# EAGLE design BEDBackpack_v11 (EAGLE 5.10)
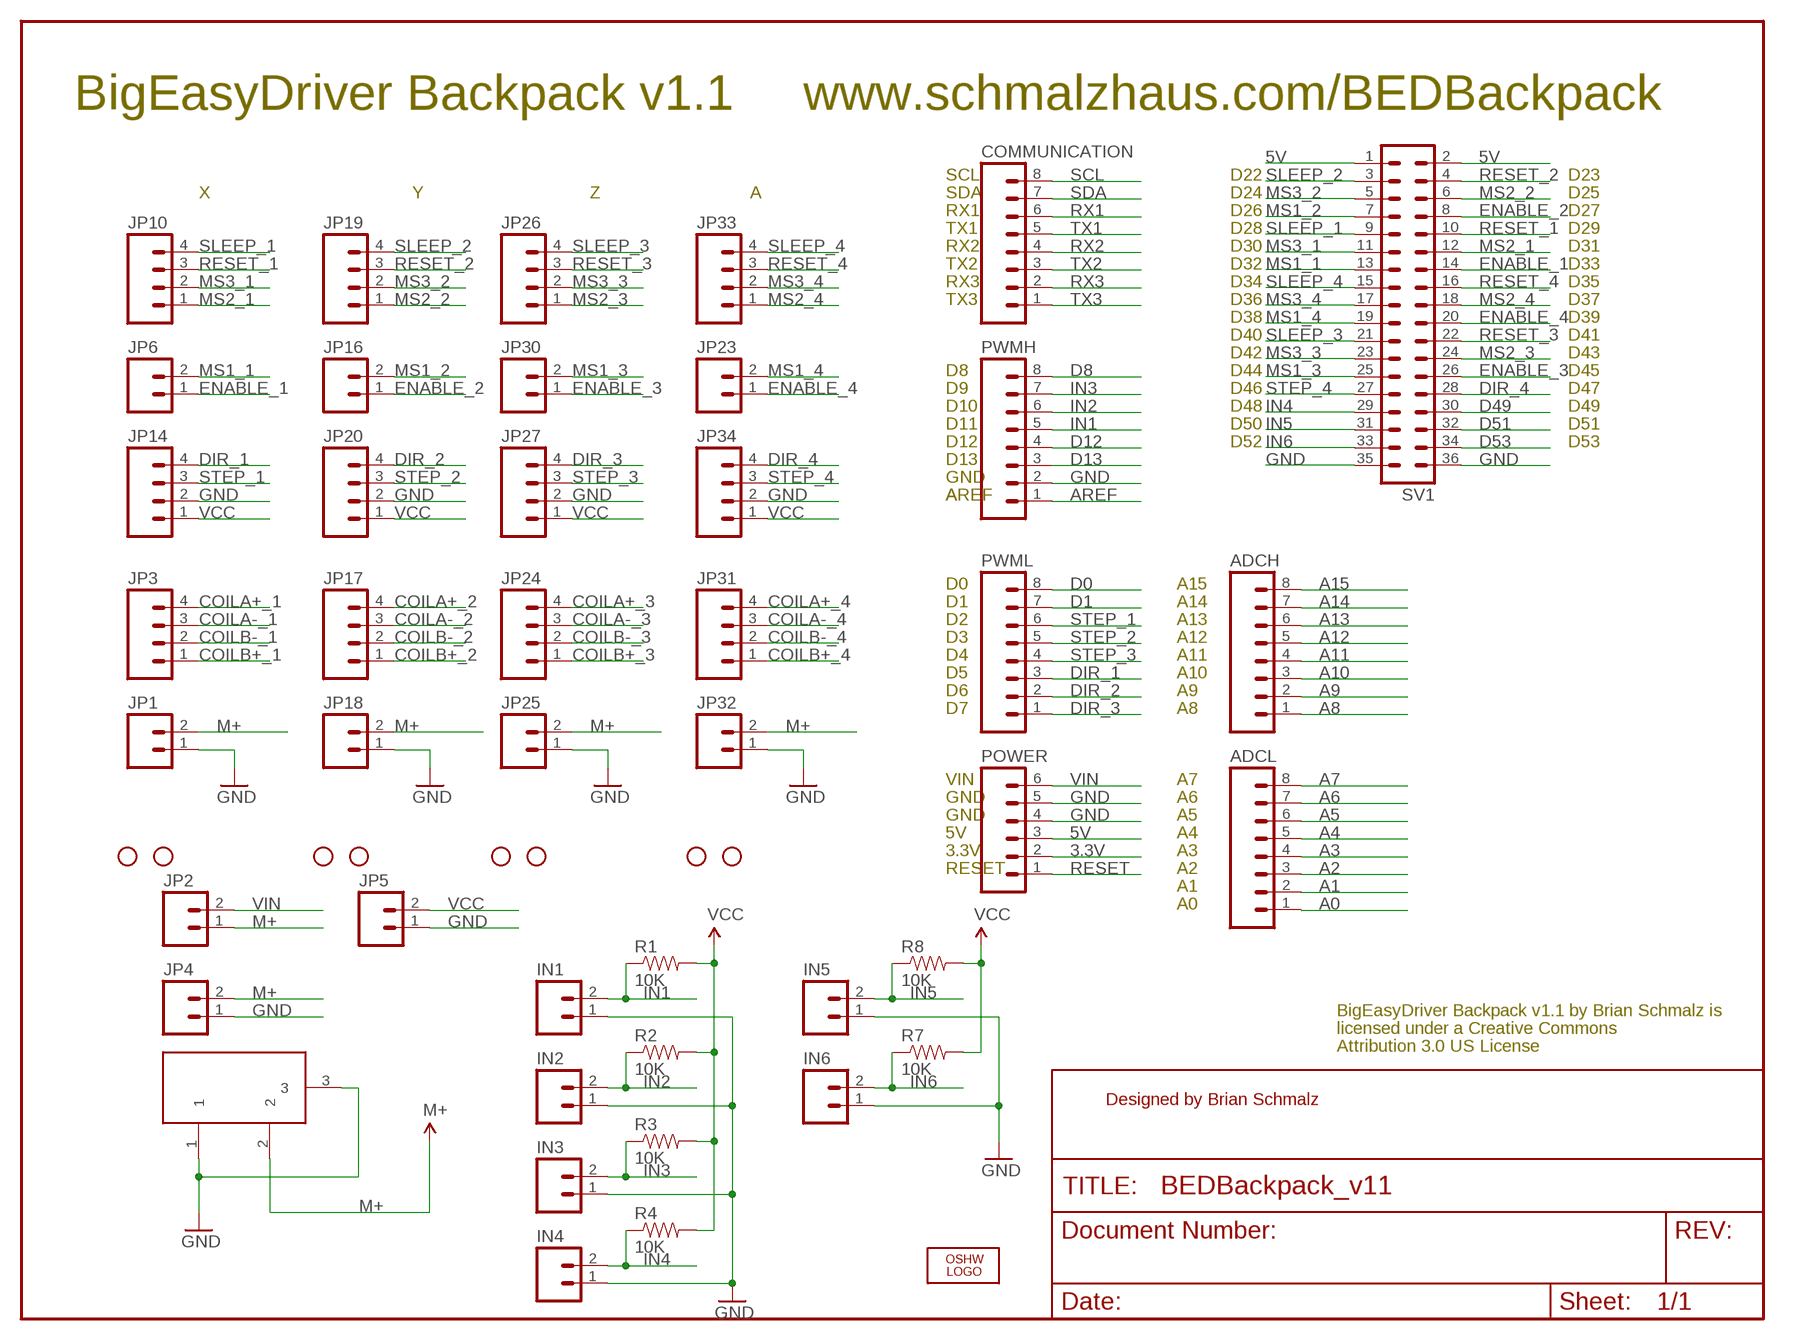
[diagram p0: schematic, sheet 1]

## Parts
ADCH  M08  [1X08]
ADCL  M08  [1X08]
COMMUNICATION  M08  [1X08]
IN1  M023.5MM  [SCREWTERMINAL-3.5MM-2]
IN2  M023.5MM  [SCREWTERMINAL-3.5MM-2]
IN3  M023.5MM  [SCREWTERMINAL-3.5MM-2]
IN4  M023.5MM  [SCREWTERMINAL-3.5MM-2]
IN5  M023.5MM  [SCREWTERMINAL-3.5MM-2]
IN6  M023.5MM  [SCREWTERMINAL-3.5MM-2]
JP1  M02PTH  [1X02]
JP2  M02PTH  [1X02]
JP3  M04PTH  [1X04]
JP4  M02PTH  [1X02]
JP5  M02PTH  [1X02]
JP6  M02PTH  [1X02]
JP8  STAND-OFF  [STAND-OFF]
JP9  STAND-OFF  [STAND-OFF]
JP10  M04PTH  [1X04]
JP13  STAND-OFF  [STAND-OFF]
JP14  M04PTH  [1X04]
JP15  STAND-OFF  [STAND-OFF]
JP16  M02PTH  [1X02]
JP17  M04PTH  [1X04]
JP18  M02PTH  [1X02]
JP19  M04PTH  [1X04]
JP20  M04PTH  [1X04]
JP21  STAND-OFF  [STAND-OFF]
JP22  STAND-OFF  [STAND-OFF]
JP23  M02PTH  [1X02]
JP24  M04PTH  [1X04]
JP25  M02PTH  [1X02]
JP26  M04PTH  [1X04]
JP27  M04PTH  [1X04]
JP28  STAND-OFF  [STAND-OFF]
JP29  STAND-OFF  [STAND-OFF]
JP30  M02PTH  [1X02]
JP31  M04PTH  [1X04]
JP32  M02PTH  [1X02]
JP33  M04PTH  [1X04]
JP34  M04PTH  [1X04]
LOGO1  OSHW_LOGO_FILLX0350-NT  [OSHW_FILLX350_NOTEXT]
POWER  M06SIP  [1X06]
PWMH  M08  [1X08]
PWML  M08  [1X08]
R1  10K  RESISTORPTH-1/6W  [1/6W-RES]
R2  10K  RESISTORPTH-1/6W  [1/6W-RES]
R3  10K  RESISTORPTH-1/6W  [1/6W-RES]
R4  10K  RESISTORPTH-1/6W  [1/6W-RES]
R7  10K  RESISTORPTH-1/6W  [1/6W-RES]
R8  10K  RESISTORPTH-1/6W  [1/6W-RES]
SV1  MA18-2  [MA18-2]
X2  DC21MMX  [DC-21MM]

## Nets
3.3V: POWER.2
5V: POWER.3 SV1.1 SV1.2
A0: ADCL.1
A1: ADCL.2
A2: ADCL.3
A3: ADCL.4
A4: ADCL.5
A5: ADCL.6
A6: ADCL.7
A7: ADCL.8
A8: ADCH.1
A9: ADCH.2
A10: ADCH.3
A11: ADCH.4
A12: ADCH.5
A13: ADCH.6
A14: ADCH.7
A15: ADCH.8
AREF: PWMH.1
COILA+_1: JP3.4
COILA+_2: JP17.4
COILA+_3: JP24.4
COILA+_4: JP31.4
COILA-_1: JP3.3
COILA-_2: JP17.3
COILA-_3: JP24.3
COILA-_4: JP31.3
COILB+_1: JP3.1
COILB+_2: JP17.1
COILB+_3: JP24.1
COILB+_4: JP31.1
COILB-_1: JP3.2
COILB-_2: JP17.2
COILB-_3: JP24.2
COILB-_4: JP31.2
D0: PWML.8
D1: PWML.7
D8: PWMH.8
D12: PWMH.4
D13: PWMH.3
D49: SV1.30
D51: SV1.32
D53: SV1.34
DIR_1: JP14.4 PWML.3
DIR_2: JP20.4 PWML.2
DIR_3: JP27.4 PWML.1
DIR_4: JP34.4 SV1.28
ENABLE_1: JP6.1 SV1.14
ENABLE_2: JP16.1 SV1.8
ENABLE_3: JP30.1 SV1.26
ENABLE_4: JP23.1 SV1.20
GND: IN1.1 IN2.1 IN3.1 IN4.1 IN5.1 IN6.1 JP1.1 JP4.1 JP5.1 JP14.2 JP18.1 JP20.2 JP25.1 JP27.2 JP32.1 JP34.2 POWER.4 POWER.5 PWMH.2 SV1.35 SV1.36 X2.1 X2.3
IN1: IN1.2 PWMH.5 R1.1
IN2: IN2.2 PWMH.6 R2.1
IN3: IN3.2 PWMH.7 R3.1
IN4: IN4.2 R4.1 SV1.29
IN5: IN5.2 R8.1 SV1.31
IN6: IN6.2 R7.1 SV1.33
M+: JP1.2 JP2.1 JP4.2 JP18.2 JP25.2 JP32.2 X2.2
MS1_1: JP6.2 SV1.13
MS1_2: JP16.2 SV1.7
MS1_3: JP30.2 SV1.25
MS1_4: JP23.2 SV1.19
MS2_1: JP10.1 SV1.12
MS2_2: JP19.1 SV1.6
MS2_3: JP26.1 SV1.24
MS2_4: JP33.1 SV1.18
MS3_1: JP10.2 SV1.11
MS3_2: JP19.2 SV1.5
MS3_3: JP26.2 SV1.23
MS3_4: JP33.2 SV1.17
RESET: POWER.1
RESET_1: JP10.3 SV1.10
RESET_2: JP19.3 SV1.4
RESET_3: JP26.3 SV1.22
RESET_4: JP33.3 SV1.16
RX1: COMMUNICATION.6
RX2: COMMUNICATION.4
RX3: COMMUNICATION.2
SCL: COMMUNICATION.8
SDA: COMMUNICATION.7
SLEEP_1: JP10.4 SV1.9
SLEEP_2: JP19.4 SV1.3
SLEEP_3: JP26.4 SV1.21
SLEEP_4: JP33.4 SV1.15
STEP_1: JP14.3 PWML.6
STEP_2: JP20.3 PWML.5
STEP_3: JP27.3 PWML.4
STEP_4: JP34.3 SV1.27
TX1: COMMUNICATION.5
TX2: COMMUNICATION.3
TX3: COMMUNICATION.1
VCC: JP5.2 JP14.1 JP20.1 JP27.1 JP34.1 R1.2 R2.2 R3.2 R4.2 R7.2 R8.2
VIN: JP2.2 POWER.6

## Notes on the sheet
- BigEasyDriver Backpack v1.1 | www.schmalzhaus.com/BEDBackpack
- SCL | D22 | D23
- X | Y | Z | A | SDA | D24 | D25
- RX1 | D26 | D27
- TX1 | D28 | D29
- RX2 | D30 | D31
- TX2 | D32 | D33
- RX3 | D34 | D35
- TX3 | D36 | D37
- D38 | D39
- D40 | D41
- D42 | D43
- D8 | D44 | D45
- D9 | D46 | D47
- D10 | D48 | D49
- D11 | D50 | D51
- D12 | D52 | D53
- D13
- GND
- A | AREF
- D0 | A15
- D1 | A14
- D2 | A13
- D3 | A12
- D4 | A11
- D5 | A10
- D6 | A9
- D7 | A8
- VIN | A7
- GND | A6
- GND | A5
- 5V | A4
- 3.3V | A3
- RESET | A2
- A1
- A0
- BigEasyDriver Backpack v1.1 by Brian Schmalz is
- licensed under a Creative Commons
- Attribution 3.0 US License
- Designed by Brian Schmalz

## Library data of the parts
ADCH ADCL COMMUNICATION PWMH PWML = SparkFun-08-03-10:M08: Header 8 Standard 8-pin 0.1" header. Use with straight break away headers (SKU : PRT-00116), right angle break away headers (PRT-00553), swiss pins (PRT-00743), machine pins (PRT-00117), and female headers (PRT-00115).
IN1-IN6 = SparkFun-08-03-10:M02: Header 2 Standard 2-pin 0.1" header. Use with straight break away headers (SKU : PRT-00116), right angle break away headers (PRT-00553), swiss pins (PRT-00743), machine pins (PRT-00117), and female headers (PRT-00115). Molex polarized connector foot print use with SKU : PRT-08233 with associated crimp pins and housings.
JP1 JP2 JP4-JP6 JP16 JP18 JP23 JP25 JP30 JP32 = SparkFun:M02: Header 2 Standard 2-pin 0.1" header. Use with straight break away headers (SKU : PRT-00116), right angle break away headers (PRT-00553), swiss pins (PRT-00743), machine pins (PRT-00117), and female headers (PRT-00115). Molex polarized connector foot print use with SKU : PRT-08233 with associated crimp pins and housings.
JP3 JP10 JP14 JP17 JP19 JP20 JP24 JP26 JP27 JP31 JP33 JP34 = SparkFun:M04: Header 4 Standard 4-pin 0.1" header. Use with straight break away headers (SKU : PRT-00116), right angle break away headers (PRT-00553), swiss pins (PRT-00743), machine pins (PRT-00117), and female headers (PRT-00115). Molex polarized connector foot print use with SKU : PRT-08231 with associated crimp pins and housings.
JP8 JP9 JP13 JP15 JP21 JP22 JP28 JP29 = SparkFun-7-28-09:STAND-OFF: Stand Off This is the mechanical footprint for a #4 phillips button head screw. Use the keepout ring to avoid running the screw head into surrounding components. SKU : PRT-00447
LOGO1 = OSHW:OSHW_LOGO_FILL
POWER = SparkFun-08-03-10:M06: Header 6 Standard 6-pin 0.1" header. Use with straight break away headers (SKU : PRT-00116), right angle break away headers (PRT-00553), swiss pins (PRT-00743), machine pins (PRT-00117), and female headers (PRT-00115). Molex polarized connector foot print use with SKU : PRT-08094 with associated crimp pins and housings. NOTES ON THE VARIANTS LOCK and LOCK_LONGPADS... This footprint was designed to help hold the alignment of a through-hole component (i.e. 6-pin header) while soldering it into place. You may notice that each hole has been shifted either up or down by 0.005 of an inch from it's more standard position (which is a perfectly straight line). This slight alteration caused the pins (the squares in the middle) to touch the edges of the holes. Because they are alternating, it causes a "brace" to hold the component in place. 0.005 has proven to be the perfect amount of "off-center" position when using our standard breakaway headers. Although looks a little odd when you look at the bare footprint, once you have a header in there, the alteration is very hard to notice. Also, if you push a header all the way into place, it is covered up entirely on the bottom side. This idea of altering the position of holes to aid alignment will be further integrated into the Sparkfun Library for other footprints. It can help hold any component with 3 or more connection pins.
R1-R4 R7 R8 = SparkFun-08-03-10:RESISTOR: Resistor Basic schematic elements and footprints for 0603, 1206, and PTH resistors.
SV1 = con-lstb:MA18-2: PIN HEADER
X2 = powersupply:DC21MM

## Net classes
0 default: width 0.203 mm, drill 0.406 mm, clearance 0.203 mm

## Board
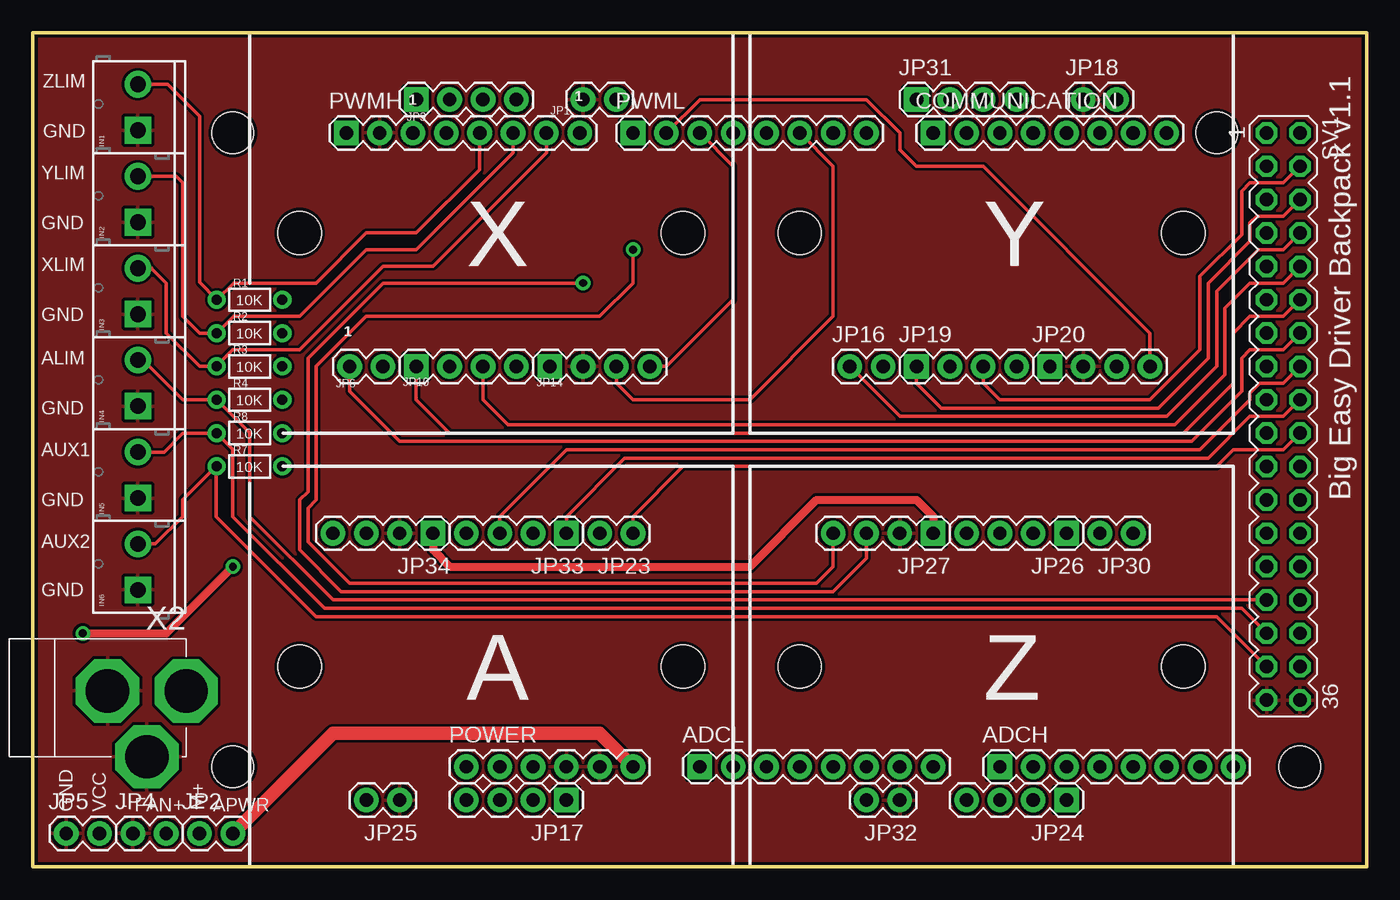
[diagram p1: board, top side]
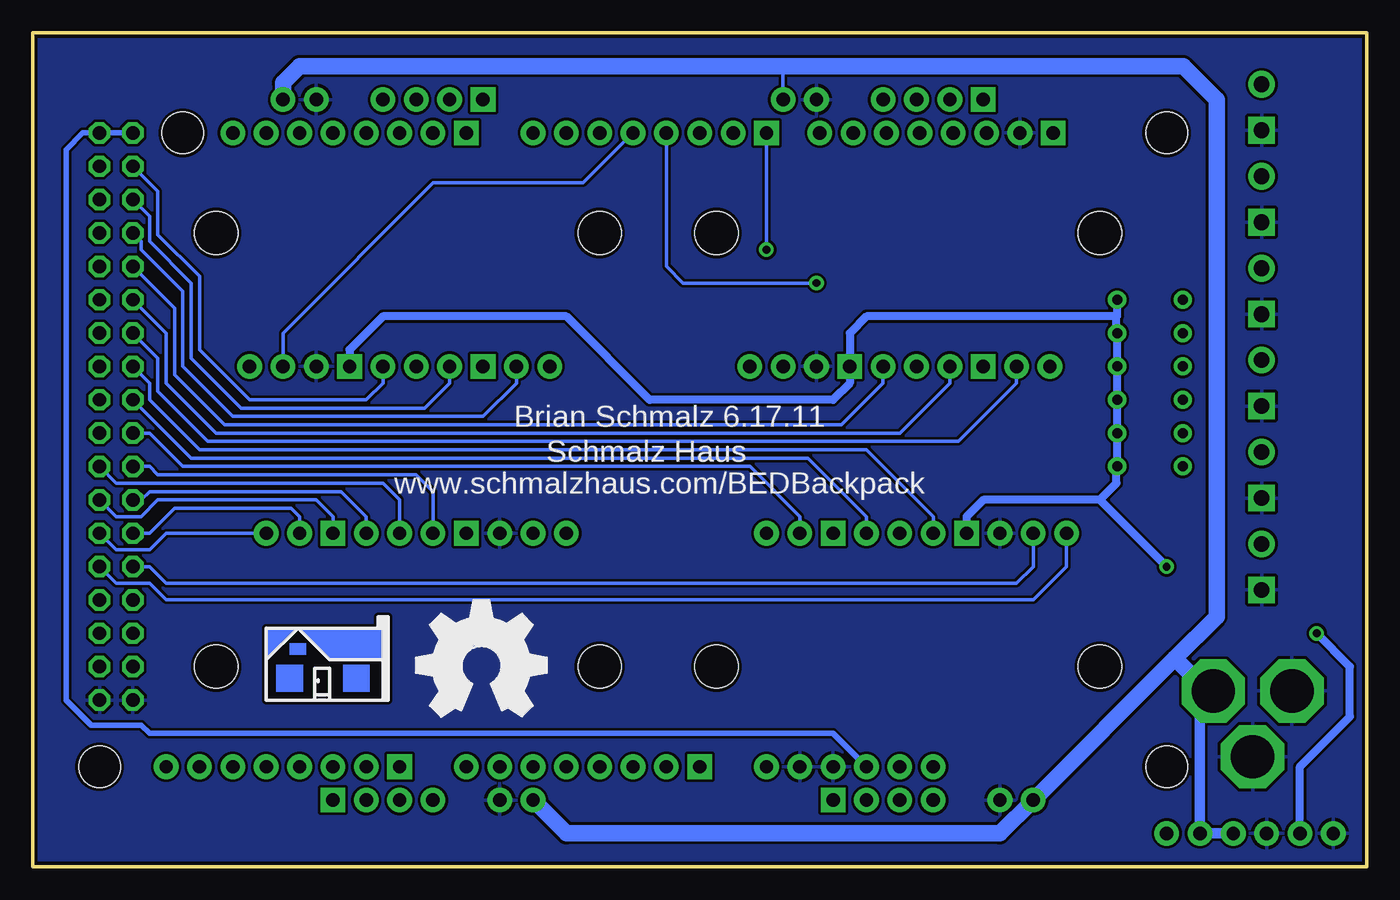
[diagram p2: board, bottom side, seen from below]

Size 101.6 x 63.5 mm. Coordinates in mm from the lower left corner, seen from the top.
Outline: 0,0 101.6,0 101.6,63.5 0,63.5 0,0
Copper layers (1*16): Top 0.035mm / dielectric 1.5mm / Bottom 0.035mm
Design rules "GoldPhoenix_8and8_4layer *": minimum track width 7mil, minimum drill 15mil, track to track 8mil, track to pad 8mil, pad to pad 8mil, via to via 8mil, smd to smd 8mil, copper to edge 10mil, drill to drill 8mil, minimum pad ring 12mil, minimum via ring 10mil, stop-mask expansion 4mil, vias tented up to drill 25mil, thermal gap 10mil
Holes 3.17 mm at 15.24,55.88 15.24,7.62 96.52,7.62 90.17,55.88

### Footprints (pad centres in the part's own frame; a part is rotated, then mirrored left to right if it is on the bottom)
1X08 = drill 1.016 pad 1.88 square: 1 0,0 | drill 1.016 pad 1.88 round: 2 2.54,0; 3 5.08,0; 4 7.62,0; 5 10.16,0; 6 12.7,0; 7 15.24,0; 8 17.78,0
SCREWTERMINAL-3.5MM-2 = drill 1.2 pad 2.032 square: 1 0,0 | drill 1.2 pad 2.032 round: 2 3.5,0
1X02 = drill 1.016 pad 1.88 round: 1 0,0; 2 2.54,0
1X04 = drill 1.016 pad 1.88 square: 1 0,0 | drill 1.016 pad 1.88 round: 2 2.54,0; 3 5.08,0; 4 7.62,0
STAND-OFF = hole 3.302: 0,0
1X06 = drill 1.016 pad 1.88 round: 1 0,0; 2 2.54,0; 3 5.08,0; 4 7.62,0; 5 10.16,0; 6 12.7,0
1/6W-RES = drill 0.762 round: 1 -2.5,0; 2 2.5,0
MA18-2 = drill 1.016 octagon: 1 -21.59,-1.27; 2 -21.59,1.27; 3 -19.05,-1.27; 4 -19.05,1.27; 5 -16.51,-1.27; 6 -16.51,1.27; 7 -13.97,-1.27; 8 -13.97,1.27; 9 -11.43,-1.27; 10 -11.43,1.27; 11 -8.89,-1.27; 12 -8.89,1.27; 13 -6.35,-1.27; 14 -6.35,1.27; 15 -3.81,-1.27; 16 -3.81,1.27; 17 -1.27,-1.27; 18 -1.27,1.27; 19 1.27,-1.27; 20 1.27,1.27; 21 3.81,-1.27; 22 3.81,1.27; 23 6.35,-1.27; 24 6.35,1.27; 25 8.89,-1.27; 26 8.89,1.27; 27 11.43,-1.27; 28 11.43,1.27; 29 13.97,-1.27; 30 13.97,1.27; 31 16.51,-1.27; 32 16.51,1.27; 33 19.05,-1.27; 34 19.05,1.27; 35 21.59,-1.27; 36 21.59,1.27
DC-21MM = drill 3.302 pad 4.826 octagon: 1 -5.08,-3.353; 2 -0.076,-6.35; 3 -0.076,-0.356

### Placement (x,y rotation side)
ADCH  73.66,7.62 0 top
ADCL  50.8,7.62 0 top
COMMUNICATION  68.58,55.88 0 top
IN1  8,56.08 90 top
IN2  8,49.08 90 top
IN3  8,42.08 90 top
IN4  8,35.08 90 top
IN5  8,28.08 90 top
IN6  8,21.08 90 top
JP1  41.91,58.42 0 top
JP2  12.7,2.54 0 top
JP3  29.21,58.42 0 top
JP4  7.62,2.54 0 top
JP5  2.54,2.54 0 top
JP6  24.13,38.1 0 top
JP8  20.32,48.26 0 top
JP9  49.53,48.26 0 top
JP10  29.21,38.1 0 top
JP13  58.42,15.24 0 top
JP14  39.37,38.1 0 top
JP15  58.42,48.26 0 top
JP16  62.23,38.1 0 top
JP17  40.64,5.08 180 top
JP18  80.01,58.42 0 top
JP19  67.31,38.1 0 top
JP20  77.47,38.1 0 top
JP21  87.63,15.24 0 top
JP22  49.53,15.24 0 top
JP23  45.72,25.4 180 top
JP24  78.74,5.08 180 top
JP25  27.94,5.08 180 top
JP26  78.74,25.4 180 top
JP27  68.58,25.4 180 top
JP28  20.32,15.24 0 top
JP29  87.63,48.26 0 top
JP30  83.82,25.4 180 top
JP31  67.31,58.42 0 top
JP32  66.04,5.08 180 top
JP33  40.64,25.4 180 top
JP34  30.48,25.4 180 top
LOGO1  72.39,11.43 0 bottom
POWER  33.02,7.62 0 top
PWMH  23.88,55.88 0 top
PWML  45.72,55.88 0 top
R1  16.51,43.18 0 top
R2  16.51,40.64 0 top
R3  16.51,38.1 0 top
R4  16.51,35.56 0 top
R7  16.51,30.48 0 top
R8  16.51,33.02 0 top
SV1  95.25,34.29 270 top
U$1  [SCHMALZHAUS]  80.01,15.24 0 bottom
X2  5.33,13.46 90 top

### Tracks (layer width: path | path; a pad name or v marks a point on that pad's centre or on a via)
5V
  Bottom 0.406: SV1.1 SV1.2 97.79,55.88 99.06,54.61 99.06,12.7 97.16,10.79 93.34,10.79 92.71,10.16 40.64,10.16 POWER.3
DIR_1
  Top 0.254: PWML.3 53.34,53.34 53.34,43.18 48.26,38.1 JP14.4
DIR_2
  Top 0.254: PWML.2 50.8,58.42 63.5,58.42 66.04,55.88 66.04,54.61 67.31,53.34 72.39,53.34 85.09,40.64 JP20.4
DIR_3  (via drill 0.6)
  Top 0.254: v45.72,46.99 45.72,44.45 43.18,41.91 25.4,41.91 21.59,38.1 21.59,27.94 20.95,27.3 20.95,24.77 24.13,21.59 59.69,21.59 60.96,22.86 JP27.4
  Bottom 0.254: v45.72,46.99 PWML.1
DIR_4
  Bottom 0.254: JP34.4 22.86,22.86 25.4,20.32 91.44,20.32 92.71,21.59 95.25,21.59 SV1.28
ENABLE_1
  Top 0.254: SV1.14 95.25,39.37 92.71,39.37 92.08,38.73 92.08,36.2 88.27,32.38 27.94,32.38 24.13,36.2 JP6.1
ENABLE_2
  Top 0.254: SV1.8 95.25,46.99 93.34,46.99 90.17,43.81 90.17,38.1 86.36,34.29 66.04,34.29 JP16.1
ENABLE_3
  Bottom 0.254: SV1.26 95.25,24.13 92.71,24.13 91.44,25.4 JP30.1
ENABLE_4
  Top 0.254: SV1.20 95.25,31.75 91.44,31.75 90.17,30.48 49.53,30.48 45.72,26.67 45.72,25.58 JP23.1
GND
  pour Bottom: 0,63.5 101.6,63.5 101.6,0 0,0
  pour Top: 0,63.5 101.6,63.5 101.6,0 0,0
IN1
  Top 0.254: IN1.2 10.27,59.58 12.7,57.15 12.7,44.49 R1.1 15.28,44.45 21.59,44.45 25.4,48.26 29.21,48.26 34.04,53.09 PWMH.5
IN2
  Top 0.254: IN2.2 10.92,52.58 11.43,52.07 11.43,41.91 12.7,40.64 R2.1 15.28,41.91 20.32,41.91 25.4,46.99 29.21,46.99 36.58,54.36 PWMH.6
IN3
  Top 0.254: IN3.2 9.07,45.58 9.07,45.54 10.16,44.45 10.16,40.64 12.7,38.1 R3.1 14.01,38.14 15.24,39.37 20.32,39.37 26.67,45.72 30.48,45.72 39.12,54.36 PWMH.7
IN4
  Top 0.254: 94.11,20.32 SV1.29 22.86,20.32 16.51,26.67 16.51,33.06 R4.1 11.43,35.56 8.41,38.58 IN4.2
IN5
  Top 0.254: SV1.31 92.08,19.68 22.23,19.68 15.24,26.67 15.24,31.79 R8.1 11.43,33.02 9.99,31.58 IN5.2
IN6
  Top 0.254: SV1.33 90.17,19.05 21.59,19.05 13.97,26.67 13.97,30.44 R7.1 13.97,30.48 11.43,27.94 11.43,26.67 9.34,24.58 IN6.2
M+
  Bottom 0.254: X2.2 11.73,13.39 | 12.01,13.39 X2.2 | X2.2 12.12,13.39 | 44.45,60.96 JP1.2
  Bottom 0.813: 63.32,4.9 JP32.2 | JP4.2 JP2.1 12.7,12.7 12.01,13.39
  Bottom 1.27: 63.32,4.9 60.96,2.54 27.94,2.54 JP25.2 14.61,15.88 | 14.61,15.88 11.43,19.05 11.43,58.42 13.97,60.96 44.45,60.96 81.28,60.96 82.55,59.69 JP18.2 | 12.12,13.39 14.61,15.88
MS1_1
  Bottom 0.254: SV1.13 92.08,38.73 92.08,36.2 88.27,32.38 31.11,32.38 26.67,36.83 26.67,37.92 JP6.2
MS1_2
  Bottom 0.254: SV1.7 93.34,47.62 93.34,46.99 90.17,43.81 90.17,38.1 86.36,34.29 67.31,34.29 64.77,36.83 64.77,37.92 JP16.2
MS1_3
  Bottom 0.254: SV1.25 92.71,25.4 90.81,27.3 81.92,27.3 81.28,26.67 JP30.2
MS1_4
  Bottom 0.254: SV1.19 92.71,33.02 90.17,30.48 46.99,30.48 43.18,26.67 43.18,25.58 JP23.2
MS2_1
  Top 0.254: SV1.12 95.25,41.91 92.71,41.91 91.44,40.64 91.44,36.83 87.63,33.02 31.75,33.02 29.21,35.56 JP10.1
MS2_2
  Top 0.254: SV1.6 95.25,49.53 93.22,49.53 92.71,49.02 92.71,47.62 89.53,44.45 89.53,38.73 85.72,34.92 69.22,34.92 67.31,36.83 JP19.1
MS2_3
  Bottom 0.254: SV1.24 95.25,26.67 93.34,26.67 92.08,27.94 80.01,27.94 78.74,26.67 JP26.1
MS2_4
  Top 0.254: SV1.18 95.25,34.29 92.71,34.29 89.53,31.11 45.09,31.11 40.64,26.67 JP33.1
MS3_1
  Bottom 0.254: SV1.11 91.44,40.64 91.44,36.83 87.63,33.02 35.56,33.02 31.75,36.83 JP10.2
MS3_2
  Bottom 0.254: SV1.5 92.71,49.53 92.71,47.62 89.53,44.45 89.53,38.73 85.72,34.92 71.75,34.92 69.85,36.83 JP19.2
MS3_3
  Bottom 0.254: SV1.23 93.34,27.94 92.71,28.57 78.11,28.57 76.2,26.67 JP26.2
MS3_4
  Bottom 0.254: SV1.17 89.53,31.11 42.55,31.11 38.1,26.67 JP33.2
RESET_1
  Top 0.254: SV1.10 95.25,44.45 92.71,44.45 90.81,42.55 90.81,37.47 87,33.66 36.2,33.66 34.29,35.56 JP10.3
RESET_2
  Top 0.254: SV1.4 95.25,52.07 92.71,52.07 92.08,51.44 92.08,48.13 88.9,44.96 88.9,39.37 85.09,35.56 73.66,35.56 72.39,36.83 JP19.3
RESET_3
  Bottom 0.254: SV1.22 95.25,29.21 74.93,29.21 73.66,27.94 JP26.3
RESET_4
  Top 0.254: SV1.16 95.25,36.83 93.47,36.83 92.71,36.07 92.71,35.56 88.9,31.75 40.64,31.75 35.56,26.67 JP33.3
SLEEP_1
  Bottom 0.254: SV1.9 90.81,42.55 90.81,37.47 87,33.66 40.01,33.66 36.83,36.83 JP10.4
SLEEP_2
  Bottom 0.254: SV1.3 92.08,51.44 92.08,48.13 88.9,44.96 88.9,39.37 85.09,35.56 76.2,35.56 74.93,36.83 JP19.4
SLEEP_3
  Bottom 0.254: SV1.21 92.71,30.48 92.08,29.84 72.39,29.84 71.12,28.57 JP26.4
SLEEP_4
  Bottom 0.254: SV1.15 92.71,36.83 92.71,35.56 88.9,31.75 38.1,31.75 33.02,26.67 JP33.4
STEP_1
  Top 0.254: JP14.3 44.45,36.83 45.72,35.56 54.61,35.56 60.96,41.91 60.96,53.34 PWML.6
STEP_2
  Bottom 0.254: PWML.5 59.69,52.07 71.12,52.07 82.55,40.64 JP20.3
STEP_3  (via drill 0.6)
  Top 0.254: v41.91,44.45 26.67,44.45 20.95,38.73 20.95,28.57 20.32,27.94 20.32,24.13 23.5,20.95 60.96,20.95 63.5,23.5 JP27.3
  Bottom 0.254: v41.91,44.45 52.07,44.45 53.34,45.72 PWML.4
STEP_4
  Bottom 0.254: SV1.27 92.71,22.86 91.44,21.59 26.67,21.59 25.4,22.86 JP34.3
VCC  (via drill 0.6)
  Top 0.61: JP27.1 68.58,26.67 67.31,27.94 59.69,27.94 54.61,22.86 31.75,22.86 30.48,24.13 JP34.1 | v3.81,17.78 10.16,17.78 v15.24,22.86
  Bottom 0.254: R2.2 19.05,40.68 | 19.05,41.91 19.01,41.95 | 19.05,30.44 R7.2
  Bottom 0.61: v3.81,17.78 1.27,15.24 1.27,11.43 5.08,7.62 JP5.2 | 20.32,27.94 19.05,29.21 19.05,30.44 | 20.32,27.94 29.21,27.94 30.48,26.67 JP34.1 | JP20.1 77.47,39.37 74.93,41.91 60.96,41.91 54.61,35.56 40.64,35.56 39.37,36.83 JP14.1 39.37,40.64 38.1,41.91 19.05,41.91 19.05,40.68 | R2.2 R3.2 R4.2 R8.2 R7.2 | 19.01,41.95 R1.2 | v15.24,22.86 20.32,27.94
VIN
  Top 0.254: JP2.2 15.42,2.72
  Top 1.016: 15.42,2.72 22.86,10.16 43.18,10.16 POWER.6

### Text on the board
tPlace: Big Easy Driver Backpack v1.1 | ZLIM | 1 | 1 | GND | YLIM | GND | X | Y | XLIM | GND | 1 | ALIM | GND | AUX1 | GND | AUX2 | GND | A | Z | GND | VCC | - | FAN | + | M+ | APWR
bPlace: Brian Schmalz 6.17.11 | Schmalz Haus | www.schmalzhaus.com/BEDBackpack